# Altium schematic sheet Microcontroller.SchDoc
size A4; SheetNumber: 3; SheetTotal: 4
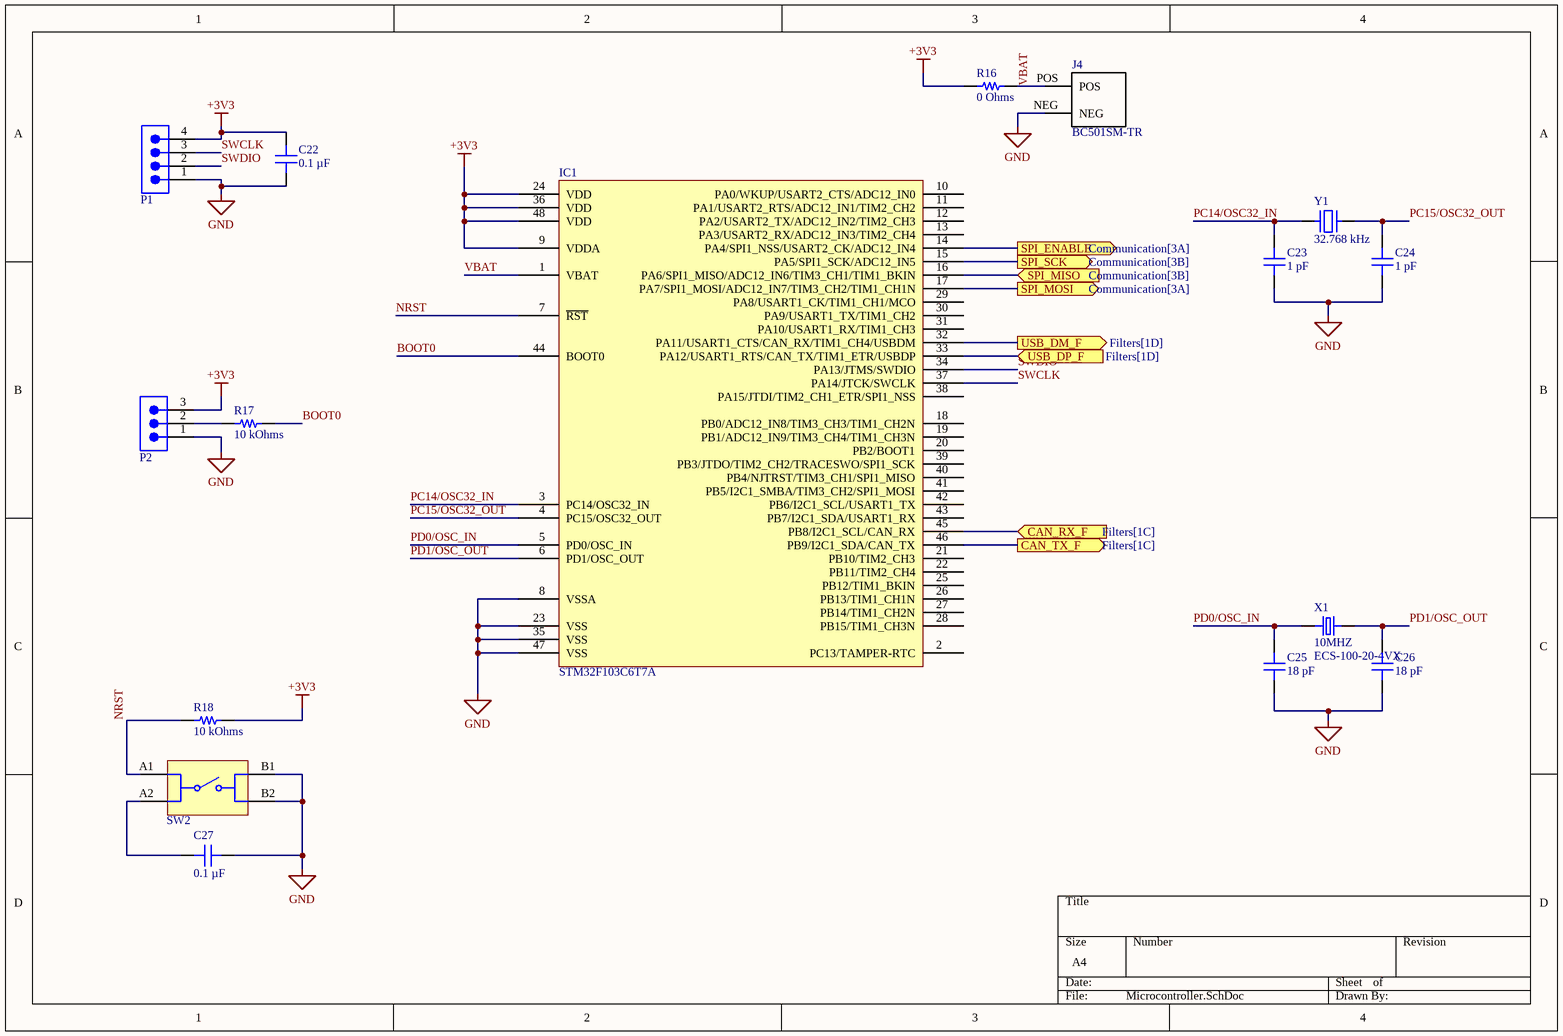
[diagram p0: Microcontroller.SchDoc]

## Parts
C22  0.1 µF  [CAP 0805_2012]
C23  1 pF  [CAP 0805_2012]
C24  1 pF  [CAP 0805_2012]
C25  18 pF  [CAP 0805_2012]
C26  18 pF  [CAP 0805_2012]
C27  0.1 µF  [CAP 0805_2012]
IC1  STM32F103C6T7A  [ST LQFP-48 7X7MM]
J4  BC501SM-TR  [*MPD_BC501SM-TR_BC501SM-TR(Primary) - duplicate]
P1  61900411121  [61900411121]  (value not drawn)
P2  61900311121  [61900311121]  (value not drawn)
R16  0 Ohms  [RES 0805_2012]
R17  10 kOhms  [RES 0805_2012]
R18  10 kOhms  [RES 0805_2012]
SW2  430152043826  [WS-TASV_L6W6H4.3_4301x20438x6]  (value not drawn)
X1  Frequency: 10MHZ  [XTAL_ECS-100-20-4VX]  (hidden comment: ECS-100-20-4VX)
Y1  32.768 kHz  [ABRACON ABS07]

## Ports
CAN_RX_F (in, see Filters[1C]), CAN_TX_F (out, see Filters[1C]), SPI_ENABLE (out, see Communication[3A]), SPI_MISO (in, see Communication[3B]), SPI_MOSI (out, see Communication[3A]), SPI_SCK (out, see Communication[3B]), USB_DM_F (out, see Filters[1D]), USB_DP_F (in, see Filters[1D])

## Nets
+3V3: C22.1 IC1.9(VDDA) IC1.24(VDD) IC1.36(VDD) IC1.48(VDD) P1.4 P2.3 R16.1 R18.2
GND: C22.2 C23.1 C24.1 C25.1 C26.1 C27.1 IC1.8(VSSA) IC1.23(VSS) IC1.35(VSS) IC1.47(VSS) J4.NEG P1.1 P2.1 SW2.B1 SW2.B2
BOOT0: IC1.44(BOOT0) R17.2
CAN_RX_F: IC1.45(PB8/I2C1_SCL/CAN_RX) ; port CAN_RX_F
CAN_TX_F: IC1.46(PB9/I2C1_SDA/CAN_TX) ; port CAN_TX_F
NRST: IC1.7(~{RST}) R18.1 SW2.A1
PC14/OSC32_IN: C23.2 IC1.3(PC14/OSC32_IN) Y1.1
PC15/OSC32_OUT: C24.2 IC1.4(PC15/OSC32_OUT) Y1.2
PD0/OSC_IN: C25.2 IC1.5(PD0/OSC_IN) X1.1
PD1/OSC_OUT: C26.2 IC1.6(PD1/OSC_OUT) X1.2
SPI_ENABLE: IC1.14(PA4/SPI1_NSS/USART2_CK/ADC12_IN4) ; port SPI_ENABLE
SPI_MISO: IC1.16(PA6/SPI1_MISO/ADC12_IN6/TIM3_CH1/TIM1_BKIN) ; port SPI_MISO
SPI_MOSI: IC1.17(PA7/SPI1_MOSI/ADC12_IN7/TIM3_CH2/TIM1_CH1N) ; port SPI_MOSI
SPI_SCK: IC1.15(PA5/SPI1_SCK/ADC12_IN5) ; port SPI_SCK
SWCLK: IC1.37(PA14/JTCK/SWCLK) P1.3
SWDIO: IC1.34(PA13/JTMS/SWDIO) P1.2
USB_DM_F: IC1.32(PA11/USART1_CTS/CAN_RX/TIM1_CH4/USBDM) ; port USB_DM_F
USB_DP_F: IC1.33(PA12/USART1_RTS/CAN_TX/TIM1_ETR/USBDP) ; port USB_DP_F
VBAT: IC1.1(VBAT) J4.POS R16.2
NetC27_2: C27.2 SW2.A2
NetP2_2: P2.2 R17.1

Not connected (* = marked no-connect by the designer): IC1 2(PC13/TAMPER-RTC) 10(PA0/WKUP/USART2_CTS/ADC12_IN0) 11(PA1/USART2_RTS/ADC12_IN1/TIM2_CH2) 12(PA2/USART2_TX/ADC12_IN2/TIM2_CH3) 13(PA3/USART2_RX/ADC12_IN3/TIM2_CH4) 18(PB0/ADC12_IN8/TIM3_CH3/TIM1_CH2N) 19(PB1/ADC12_IN9/TIM3_CH4/TIM1_CH3N) 20(PB2/BOOT1) 21(PB10/TIM2_CH3) 22(PB11/TIM2_CH4) 25(PB12/TIM1_BKIN) 26(PB13/TIM1_CH1N) 27(PB14/TIM1_CH2N) 28(PB15/TIM1_CH3N) 29(PA8/USART1_CK/TIM1_CH1/MCO) 30(PA9/USART1_TX/TIM1_CH2) 31(PA10/USART1_RX/TIM1_CH3) 38(PA15/JTDI/TIM2_CH1_ETR/SPI1_NSS) 39(PB3/JTDO/TIM2_CH2/TRACESWO/SPI1_SCK) 40(PB4/NJTRST/TIM3_CH1/SPI1_MISO) 41(PB5/I2C1_SMBA/TIM3_CH2/SPI1_MOSI) 42(PB6/I2C1_SCL/USART1_TX) 43(PB7/I2C1_SDA/USART1_RX)

## Library data of the parts
C22 C27 = CC0805MRX7R9BB104: CAP CER 0.1UF 50V X7R 0805; manufacturer: Yageo; Tolerance: ±20%; Part Number: CC0805MRX7R9BB104; Value: 0.1 µF; Applications: General Purpose; Capacitance: 0.1 µF; componentlink1description: Datasheet; componentlink1url: https://www.yageo.com/upload/media/product/productsearch/datasheet/mlcc/UPY-GPHC_X7R_6.3V-to-50V_18.pdf; componentlink2description: DigiKey Link; componentlink2url: https://www.digikey.com/en/products/detail/yageo/CC0805MRX7R9BB104/5884281; Device Package: 0805 (2012 Metric); lastupdated: 9.02.2024 20:16:09; Lifecycle Status: Active; Minimum Order: 1; Mounting Type: Surface Mount, MLCC; Operating Temperature: -55°C ~ 125°C; Package / Case: 0805 (2012 Metric); packaging: TapeAndReel; partid: 2475; Part Status: Active; price: 0.01; series: CC; Size / Dimension: 0.079" L x 0.049" W (2.00mm x 1.25mm); Supplier 1: DigiKey; Supplier Part Number 1: 311-4351-1-ND; Temperature Coefficient: X7R; Thickness (Max): 0.037" (0.95mm); Voltage - Rated: 50V
C23 C24 = CC0805CRNPO9BN1R0: CAP CER 1PF 50V C0G/NPO 0805; manufacturer: Yageo; Temperature Coefficient: C0G, NP0; Tolerance: ±0.25pF; Part Number: CC0805CRNPO9BN1R0; Value: 1 pF; Applications: General Purpose; Capacitance: 1 pF; componentlink1description: Datasheet; componentlink1url: https://www.yageo.com/upload/media/product/productsearch/datasheet/mlcc/UPY-GP_NP0_16V-to-50V_17.pdf; componentlink2description: DigiKey Link; componentlink2url: https://www.digikey.com/en/products/detail/yageo/CC0805CRNPO9BN1R0/302823; Device Package: 0805 (2012 Metric); lastupdated: 9.02.2024 20:15:42; Lifecycle Status: Active; Minimum Order: 1; Mounting Type: Surface Mount, MLCC; Operating Temperature: -55°C ~ 125°C; Package / Case: 0805 (2012 Metric); packaging: TapeAndReel; partid: 12750; Part Status: Active; price: 0.01; series: CC; Size / Dimension: 0.079" L x 0.049" W (2.00mm x 1.25mm); Supplier 1: DigiKey; Supplier Part Number 1: 311-1089-1-ND; Thickness (Max): 0.024" (0.60mm); Voltage - Rated: 50V
C25 C26 = VJ0805A180JXXCW1BC: CAP CER 18PF 25V C0G/NP0 0805; manufacturer: Vishay Vitramon; Temperature Coefficient: C0G, NP0; Tolerance: ±5%; Part Number: VJ0805A180JXXCW1BC; Value: 18 pF; Applications: General Purpose; Capacitance: 18 pF; componentlink1description: Datasheet; componentlink1url: https://www.vishay.com/docs/28548/vjw1bcbascomseries.pdf; componentlink2description: DigiKey Link; componentlink2url: https://www.digikey.com/en/products/detail/vishay-vitramon/VJ0805A180JXXCW1BC/8307782; Device Package: 0805 (2012 Metric); lastupdated: 9.02.2024 20:15:03; Lifecycle Status: Active; Minimum Order: 1; Mounting Type: Surface Mount, MLCC; Operating Temperature: -55°C ~ 125°C; Package / Case: 0805 (2012 Metric); packaging: TapeAndReel; partid: 31672; Part Status: Active; price: 0.01; series: VJ W1BC; Size / Dimension: 0.079" L x 0.049" W (2.00mm x 1.25mm); Supplier 1: DigiKey; Supplier Part Number 1: 720-VJ0805A180JXXCW1BCCT-ND; Thickness (Max): 0.028" (0.70mm); Voltage - Rated: 25V
IC1 = STM32F103C6T7A: IC MCU 32BIT 32KB FLASH 48LQFP; Manufacturer: STMicroelectronics; Connectivity: CANbus, I²C, IrDA, LINbus, SPI, UART/USART, USB; Core Processor: ARM® Cortex®-M3; Core Size: 32-Bit; Data Converters: A/D 10x12b; Number of I/O: 37; Oscillator Type: Internal; Peripherals: DMA, Motor Control PWM, PDR, POR, PVD, PWM, Temp Sensor, WDT; Program Memory Size: 32KB (32K x 8); RAM Size: 10K x 8; Speed: 72MHz; Voltage - Supply (Vcc/Vdd): 2V ~ 3.6V; Part Number: STM32F103C6T7A; ComponentLink1Description: Datasheet; ComponentLink1URL: http://www.st.com/content/ccc/resource/technical/document/datasheet/0d/93/e0/d7/77/bf/4c/54/CD00210843.pdf/files/CD00210843.pdf/jcr:content/translations/en.CD00210843.pdf; ComponentLink2Description: DigiKey Link; ComponentLink2URL: //digikey.com/product-detail/en/stmicroelectronics/STM32F103C6T7A/497-11516-ND/2035348; Device Package: 48-LQFP; LastUpdated: 4.12.2019 05:20:26; Lifecycle Status: 0; Minimum Order: 1; Mounting Type: Surface Mount; Operating Temperature: -40°C ~ 105°C (TA); Package / Case: 48-LQFP; Packaging: Tray; PartId: 102; Part Status: Active; Price: 4.52; Program Memory Type: FLASH; Series: STM32F1; Supplier 1: DigiKey; Supplier Part Number 1: 497-11516-ND; Supplier Device Package: 48-LQFP (7x7)
J4 = BC501SM-TR: Holder Coin Cell For Cr1220 Smd; MF: MPD _Memory; Digi-Key_Purchase_URL: https://www.digikey.com/product-detail/en/mpd-memory-protection-devices/BC501SM-TR/BC501SM-TRCT-ND/5418194?utm_source=snapeda&utm_medium=aggregator&utm_campaign=symbol; SnapEDA_Link: https://www.snapeda.com/parts/BC501SM-TR/MPD%20%28Memory%20Protection%20Devices%29/view-part/479427/?ref=snap; MP: BC501SM-TR; Digi-Key_Part_Number: BC501SM-TRCT-ND; Package: DFN-8 MPD; Value: *
P1 = 61900411121: WR-WTB THT Male Vertical Locking Header, pitch 2.54mm, 4pins; Manufacturer: Wurth Elektronik; Contact Resistance: 20mOhm; Rated Current: 3A; Working Voltage: 250VAC; Withstanding Voltage: 1000VAC; Manufacturer Part Number: 61900411121; Category: Wire-to-Board Connectors; Match Code: WR-WTB; ComponentLink1Description: Website Link; ComponentLink1URL: https://www.we-online.com/redexpert/article/61900411121?ad; ComponentLink2Description: Datasheet Link; ComponentLink2URL: https://www.we-online.com/redexpert/spec/61900411121?ad; Mount: Through Hole; Operating Temperature Max: 105°C; Operating Temperature Min: -40°C; Packaging: Bag; Length: 10.16mm; Width: 5.8mm; Height: 11.5mm; Gender: Male; Number of Pins: 4; Number of Rows: 1; Orientation: Vertical; Pitch: 2.54mm
P2 = 61900311121: WR-WTB THT Male Vertical Locking Header, pitch 2.54mm, 3pins; Manufacturer: Wurth Elektronik; Contact Resistance: 20mOhm; Rated Current: 3A; Working Voltage: 250VAC; Withstanding Voltage: 1000VAC; Manufacturer Part Number: 61900311121; Category: Wire-to-Board Connectors; Match Code: WR-WTB; ComponentLink1Description: Website Link; ComponentLink1URL: https://www.we-online.com/redexpert/article/61900311121?ad; ComponentLink2Description: Datasheet Link; ComponentLink2URL: https://www.we-online.com/redexpert/spec/61900311121?ad; Mount: Through Hole; Operating Temperature Max: 105°C; Operating Temperature Min: -40°C; Packaging: Bag; Length: 7.62mm; Width: 5.8mm; Height: 11.5mm; Gender: Male; Number of Pins: 3; Number of Rows: 1; Orientation: Vertical; Pitch: 2.54mm
R16 = 5107: RES 0 OHM JUMPER 0805; Part Number: 5107; Manufacturer: Keystone Electronics; Power (Watts): 0.5W, 1/2W; Value: 0 Ohms; ComponentLink1Description: Datasheet; ComponentLink1URL: http://www.keyelco.com/product-pdf.cfm?p=14350; ComponentLink2Description: DigiKey Link; ComponentLink2URL: https://www.digikey.com/en/products/detail/keystone-electronics/5107/7942981; Composition: Metal Element; Device Package: 0805 (2012 Metric); Height - Seated (Max): 0.033" (0.84mm); LastUpdated: 8.02.2024 21:01:23; Lifecycle Status: Active; Minimum Order: 1; Number of Terminations: 2; Package / Case: 0805 (2012 Metric); Packaging: TapeAndReel; PartId: 45276; Part Status: Active; Price: 0.16; Resistance: 0 Ohms; Series: -; Size / Dimension: 0.079" L x 0.049" W (2.00mm x 1.25mm); Supplier 1: DigiKey; Supplier Part Number 1: 36-5107CT-ND; Supplier Device Package: 0805; Tolerance: Jumper
R17 R18 = 2176093-5: RES SMD 10K OHM 0.1% 1/4W 0805; Manufacturer: TE Connectivity Passive Product; Power (Watts): 0.25W, 1/4W; Temperature Coefficient: ±25ppm/°C; Part Number: 2176093-5; Value: 10 kOhms; ComponentLink1Description: Datasheet; ComponentLink1URL: https://www.te.com/commerce/DocumentDelivery/DDEController?Action=srchrtrv&DocNm=1773272&DocType=DS&DocLang=English; ComponentLink2Description: DigiKey Link; ComponentLink2URL: https://www.digikey.com/en/products/detail/te-connectivity-passive-product/2176093-5/4034107; Composition: Thin Film; Device Package: 0805 (2012 Metric); Height - Seated (Max): 0.026" (0.65mm); LastUpdated: 8.02.2024 21:02:35; Lifecycle Status: Active; Minimum Order: 1; Number of Terminations: 2; Operating Temperature: -55°C ~ 155°C; Package / Case: 0805 (2012 Metric); Packaging: TapeAndReel; PartId: 28478; Part Status: Active; Price: 0.14; Resistance: 10 kOhms; Series: RP73P, Holsworthy; Size / Dimension: 0.079" L x 0.049" W (2.00mm x 1.25mm); Supplier 1: DigiKey; Supplier Part Number 1: A110639CT-ND; Supplier Device Package: 0805; Tolerance: ±0.1%
SW2 = 430152043826: WS-TASV SMT Tact Switch, L6 x W6 x H4.3mm, 260g, SPST-NO, 12V, 50mA; Manufacturer: Wurth Elektronik; Washable: No; Manufacturer Part Number: 430152043826; Category: Tact Switches; Match Code: WS-TASV; ComponentLink1Description: Website Link; ComponentLink1URL: https://www.we-online.com/redexpert/article/430152043826?ad; ComponentLink2Description: Datasheet Link; ComponentLink2URL: https://www.we-online.com/redexpert/spec/430152043826?ad; Mount: Surface Mount; Operating Temperature Max: 85°C; Operating Temperature Min: -40°C; Packaging: Tape and Reel; Length: 6mm; Width: 6mm; Height: 4.3mm; Circuit: SPST-NO; Contact Material: Stainless Steel; Contact Plating: Silver; Operation Force: 260g; Rated Current: 50mA; Rated Voltage (DC): 12V; Terminal Material: Copper Alloy; Terminal Plating: Silver
X1 = ECS-100-20-4VX: ECS-100-20-4VX 10MHz; Manufacturer: ESC INC; Frequency Stability: ±50ppm; Lifcycle Status: Active; Load Capacitance: 20 pF; Operating Mode: Fumdamental; ESR (Equivalent Series Resistance): 80 Ohms; Drive Level: 500 uW; Aging (First Year) @ 25°C: ±5 ppm; Frequency Tolerance: ±50ppm; Mounting Type: Through Hole; Supplier 1: Arrow Electronics; Operating Temperature: -10°C ~ 70°C; Packaging: HC-49UCCX; Datasheet: https://ecsxtal.com/store/pdf/HC-49USS.pdf; Supplier Part Number 1: ECS-100-20-4VX
Y1 = ABS07-32.768KHZ-6-T: CRYSTAL 32.7680KHZ 6PF SMD; Manufacturer: Abracon LLC; ESR (Equivalent Series Resistance): 70 kOhms; Frequency Tolerance: ±20ppm; Operating Mode: Fundamental; Part Number: ABS07-32.768KHZ-6-T; ComponentLink1Description: Datasheet; ComponentLink1URL: https://abracon.com/Resonators/ABS07.pdf; ComponentLink2Description: DigiKey Link; ComponentLink2URL: https://www.digikey.com/en/products/detail/abracon-llc/ABS07-32-768KHZ-6-T/3508065; Frequency: 32.768 kHz; Height - Seated (Max): 0.035" (0.90mm); LastUpdated: 3.06.2024 20:02:04; Lifecycle Status: Active; Load Capacitance: 6pF; Minimum Order: 1; Mounting Type: Surface Mount; Operating Temperature: -40°C ~ 85°C; Package / Case: 2-SMD, No Lead; Packaging: TapeAndReel; PartId: 379; Part Status: Active; Price: 0.37; Series: ABS07; Size / Dimension: 0.126" L x 0.059" W (3.20mm x 1.50mm); Supplier 1: DigiKey; Supplier Part Number 1: 535-11898-1-ND; Type: kHz Crystal (Tuning Fork); Value: 32.768 kHz